# Altium schematic sheet Sheet1.SchDoc
size A; SheetNumber: 1; SheetTotal: 1
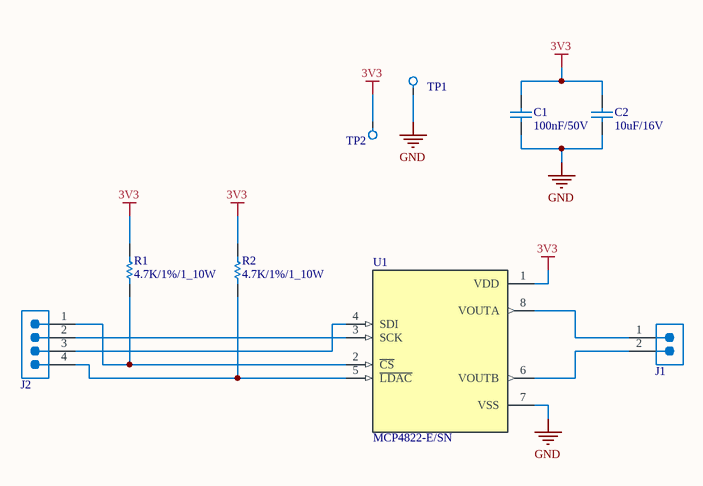
[diagram p0: Sheet1.SchDoc]

## Parts
C1  100nF/50V  [CAP_0603]
C2  10uF/16V  [CAP_0603]
J1  2.54mm_2P  [Header_2.54mm_2P]  (value not drawn)
J2  2.54mm_4P  [Header_2.54mm_4P]  (value not drawn)
R1  4.7K/1%/1_10W  [Resistor_0603]
R2  4.7K/1%/1_10W  [Resistor_0603]
TP1  Testpoint_SMD  [TestPoint_Pad_2.0x2.0mm]  (value not drawn)
TP2  Testpoint_SMD  [TestPoint_Pad_2.0x2.0mm]  (value not drawn)
U1  MCP4822-E/SN  [SOIC-8]

## Nets
3V3: C1.2 C2.2 R1.2 R2.2 TP2.1 U1.1(VDD)
GND: C1.1 C2.1 TP1.1 U1.7(VSS)
NetJ1_1: J1.1 U1.8(VOUTA)
NetJ1_2: J1.2 U1.6(VOUTB)
NetJ2_1: J2.1 R1.1 U1.2(~{CS})
NetJ2_2: J2.2 U1.3(SCK)
NetJ2_3: J2.3 U1.4(SDI)
NetJ2_4: J2.4 R2.1 U1.5(~{LDAC})

## Library data of the parts
C1 = Ceramic_Cap_100nF_50V_0603: CAP, size 0603, 100nF, 50V; Supply Part Number: Tụ Gốm 0603 100nF (0.1uF) 50V; Supply Name: Thegioiic; Datasheet: *; Supply URL: https://www.thegioiic.com/tu-gom-0603-100nf-0-1uf-50v
C2 = Ceramic_Cap_10uF_16V_0603: CAP, size 0603, 10uF, 16V; Supply Part Number: Tụ Gốm 0603 10uF 16V; Supply Name: Thegioiic; Datasheet: *; Supply URL: https://www.thegioiic.com/tu-gom-0603-10uf-16v
J1 = Header_2.54mm_2P: Hàng Rào Đực Đơn 2.54mm 40 Chân 1 Hàng Cao 11.2mm Xuyên Lỗ; Supply Name: Thegioiic; Supply Part Number: Hàng Rào Đực Đơn 2.54mm 40 Chân 1 Hàng Cao 11.2mm Xuyên Lỗ; Supply URL: https://www.thegioiic.com/hang-rao-duc-don-2-54mm-40-chan-1-hang-cao-11-2mm-xuyen-lo
J2 = Header_2.54mm_4P: Hàng Rào Đực Đơn 2.54mm 40 Chân 1 Hàng Cao 11.2mm Xuyên Lỗ; Supply Name: Thegioiic; Supply Part Number: Hàng Rào Đực Đơn 2.54mm 40 Chân 1 Hàng Cao 11.2mm Xuyên Lỗ; Supply URL: https://www.thegioiic.com/hang-rao-duc-don-2-54mm-40-chan-1-hang-cao-11-2mm-xuyen-lo
R1 R2 = Res_4.7K_0603_1%: Resistor 0603 4.7KOhm 1% 1_10W; Supply Part Number: Điện Trở 4.7 KOhm 0603 1%; Supply Name: Thegioiic; Supply URL: https://www.thegioiic.com/dien-tro-4-7-kohm-0603-1-
U1 = MCP4822-E/SN: 12 Bit Digital to Analog Converter 2 8-SOIC; Supply Part Number: MCP4822-E/SN SOIC-8 DAC 12Bit Chính Hãng Microchip; Supply Name: BanLinhKien; Datasheet: https://ww1.microchip.com/downloads/aemDocuments/documents/OTH/ProductDocuments/DataSheets/20002249B.pdf; Supply URL: https://banlinhkien.com/m4822esn-soic8-dac-12bit-chinh-hang-microchip-p6651182.html
TP1 TP2 = Testpoint_SMD: Datasheet: *; Supply Name: *; Supply Part Number: *; Supply URL: *